# Altium project STEPPER-Board-v1.0.PrjPcb (part 1 of 7)
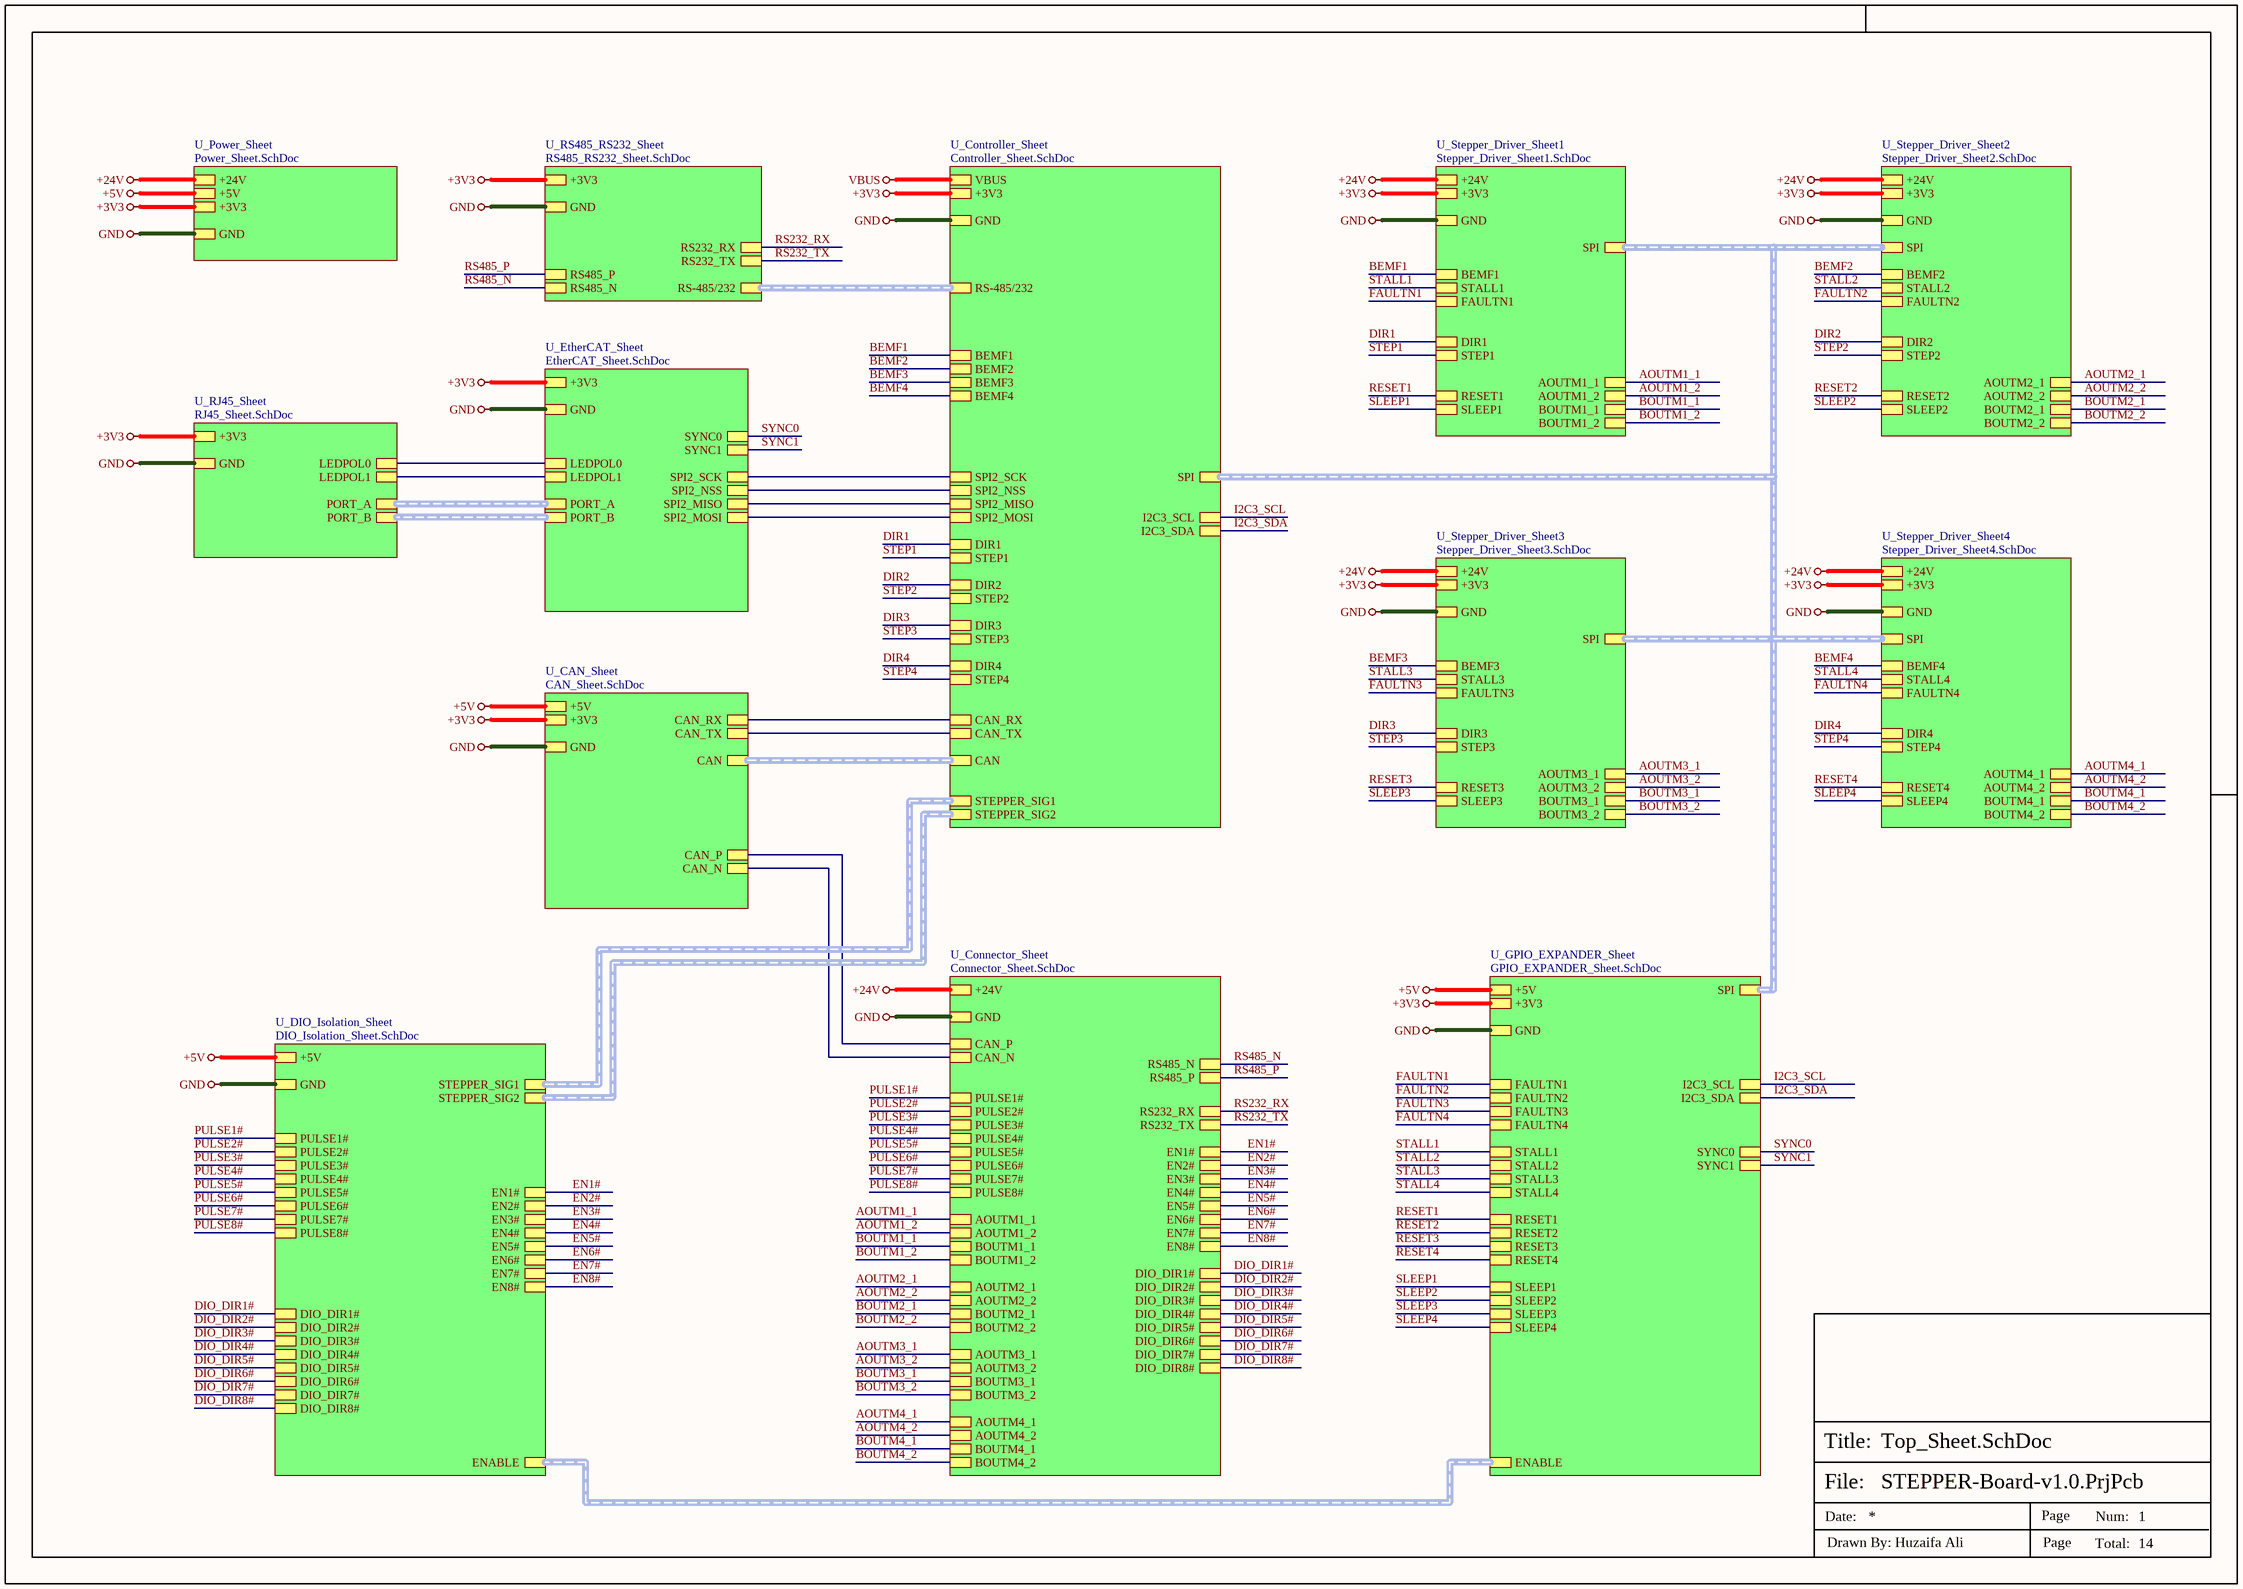
[diagram p0: Top_Sheet.SchDoc]
14 sheets, 379 parts. Net scope: hierarchical (ports join the sheet entries above them; power ports are global).
Sheets:
  Top_Sheet.SchDoc
    U_CAN_Sheet = CAN_Sheet.SchDoc
    U_Connector_Sheet = Connector_Sheet.SchDoc
    U_Controller_Sheet = Controller_Sheet.SchDoc
    U_EtherCAT_Sheet = EtherCAT_Sheet.SchDoc
    U_GPIO_EXPANDER_Sheet = GPIO_EXPANDER_Sheet.SchDoc
    U_Power_Sheet = Power_Sheet.SchDoc
    U_RJ45_Sheet = RJ45_Sheet.SchDoc
    U_RS485_RS232_Sheet = RS485_RS232_Sheet.SchDoc
    U_Stepper_Driver_Sheet1 = Stepper_Driver_Sheet1.SchDoc
    U_Stepper_Driver_Sheet2 = Stepper_Driver_Sheet2.SchDoc
    U_Stepper_Driver_Sheet3 = Stepper_Driver_Sheet3.SchDoc
    U_Stepper_Driver_Sheet4 = Stepper_Driver_Sheet4.SchDoc
    U_DIO_Isolation_Sheet = DIO_Isolation_Sheet.SchDoc

## Sheet Top_Sheet.SchDoc
size 420 x 297 mm; SheetNumber: 1; SheetTotal: 14

### Sub-sheets
U_CAN_Sheet = CAN_Sheet.SchDoc: CAN (harness CAN), CAN_RX, CAN_TX, CAN_P, CAN_N, +5V, +3V3, GND
U_Connector_Sheet = Connector_Sheet.SchDoc: RS485_N, RS485_P, RS232_RX, RS232_TX, CAN_P, CAN_N, AOUTM1_1, AOUTM1_2, BOUTM1_1, BOUTM1_2, AOUTM2_1, AOUTM2_2, BOUTM2_1, BOUTM2_2, AOUTM3_1, AOUTM3_2, BOUTM3_1, BOUTM3_2, AOUTM4_1, AOUTM4_2, BOUTM4_1, BOUTM4_2, +24V, GND, EN1#, EN2#, EN3#, EN4#, EN5#, EN6#, EN7#, EN8#, DIO_DIR1#, DIO_DIR2#, DIO_DIR3#, DIO_DIR4#, DIO_DIR5#, DIO_DIR6#, DIO_DIR7#, DIO_DIR8#, PULSE1#, PULSE2#, PULSE3#, PULSE4#, PULSE5#, PULSE6#, PULSE7#, PULSE8#
U_Controller_Sheet = Controller_Sheet.SchDoc: CAN (harness CAN), CAN_RX, CAN_TX, RS-485/232 (harness RS-485/232), VBUS, +3V3, GND, SPI2_SCK, SPI2_NSS, SPI2_MISO, SPI2_MOSI, STEPPER_SIG1 (harness STEPPER_SIG1), STEPPER_SIG2 (harness STEPPER_SIG2), BEMF1, BEMF2, BEMF3, BEMF4, SPI (harness SPI), DIR1, STEP2, DIR2, STEP3, DIR3, STEP4, DIR4, STEP1, I2C3_SCL, I2C3_SDA
U_DIO_Isolation_Sheet = DIO_Isolation_Sheet.SchDoc: +5V, GND, PULSE1#, PULSE2#, PULSE3#, PULSE4#, PULSE5#, PULSE6#, PULSE7#, PULSE8#, DIO_DIR1#, DIO_DIR2#, DIO_DIR3#, DIO_DIR4#, DIO_DIR5#, DIO_DIR6#, DIO_DIR7#, DIO_DIR8#, EN1#, EN2#, EN3#, EN4#, EN5#, EN6#, EN7#, EN8#, STEPPER_SIG1 (harness STEPPER_SIG1), STEPPER_SIG2 (harness STEPPER_SIG2), ENABLE (harness ENABLE)
U_EtherCAT_Sheet = EtherCAT_Sheet.SchDoc: PORT_A (harness PORT_A), PORT_B (harness PORT_B), LEDPOL0, LEDPOL1, SPI2_SCK, SPI2_NSS, SPI2_MISO, SPI2_MOSI, +3V3, GND, SYNC1, SYNC0
U_GPIO_EXPANDER_Sheet = GPIO_EXPANDER_Sheet.SchDoc: ENABLE (harness ENABLE), SPI (harness SPI), FAULTN1, FAULTN2, FAULTN3, FAULTN4, STALL1, STALL2, STALL3, STALL4, RESET1, RESET2, RESET3, RESET4, I2C3_SCL, I2C3_SDA, SLEEP4, SLEEP3, SLEEP2, SLEEP1, +5V, +3V3, GND, SYNC1, SYNC0
U_Power_Sheet = Power_Sheet.SchDoc: +24V, +5V, +3V3, GND
U_RJ45_Sheet = RJ45_Sheet.SchDoc: PORT_A (harness PORT_A), PORT_B (harness PORT_B), LEDPOL0, LEDPOL1, +3V3, GND
U_RS485_RS232_Sheet = RS485_RS232_Sheet.SchDoc: RS485_N, RS485_P, RS232_RX, RS232_TX, RS-485/232 (harness RS-485/232), +3V3, GND
U_Stepper_Driver_Sheet1 = Stepper_Driver_Sheet1.SchDoc: AOUTM1_1, AOUTM1_2, BOUTM1_1, BOUTM1_2, BEMF1, SPI (harness SPI), STALL1, FAULTN1, DIR1, STEP1, RESET1, SLEEP1, +24V, +3V3, GND
U_Stepper_Driver_Sheet2 = Stepper_Driver_Sheet2.SchDoc: AOUTM2_1, AOUTM2_2, BOUTM2_1, BOUTM2_2, SPI (harness SPI), BEMF2, STALL2, FAULTN2, DIR2, STEP2, RESET2, SLEEP2, +24V, +3V3, GND
U_Stepper_Driver_Sheet3 = Stepper_Driver_Sheet3.SchDoc: AOUTM3_1, AOUTM3_2, BOUTM3_1, BOUTM3_2, SPI (harness SPI), BEMF3, STALL3, FAULTN3, DIR3, STEP3, RESET3, SLEEP3, +24V, +3V3, GND
U_Stepper_Driver_Sheet4 = Stepper_Driver_Sheet4.SchDoc: AOUTM4_1, AOUTM4_2, BOUTM4_1, BOUTM4_2, SPI (harness SPI), BEMF4, STALL4, FAULTN4, DIR4, STEP4, RESET4, SLEEP4, +24V, +3V3, GND

### Nets
+3V3: sheet U_CAN_Sheet/+3V3, sheet U_Controller_Sheet/+3V3, sheet U_EtherCAT_Sheet/+3V3, sheet U_GPIO_EXPANDER_Sheet/+3V3, sheet U_Power_Sheet/+3V3, sheet U_RJ45_Sheet/+3V3, sheet U_RS485_RS232_Sheet/+3V3, sheet U_Stepper_Driver_Sheet1/+3V3, sheet U_Stepper_Driver_Sheet2/+3V3, sheet U_Stepper_Driver_Sheet3/+3V3, sheet U_Stepper_Driver_Sheet4/+3V3
+5V: sheet U_CAN_Sheet/+5V, sheet U_GPIO_EXPANDER_Sheet/+5V, sheet U_Power_Sheet/+5V, sheet U_DIO_Isolation_Sheet/+5V
+24V: sheet U_Connector_Sheet/+24V, sheet U_Power_Sheet/+24V, sheet U_Stepper_Driver_Sheet1/+24V, sheet U_Stepper_Driver_Sheet2/+24V, sheet U_Stepper_Driver_Sheet3/+24V, sheet U_Stepper_Driver_Sheet4/+24V
GND: sheet U_CAN_Sheet/GND, sheet U_Connector_Sheet/GND, sheet U_Controller_Sheet/GND, sheet U_EtherCAT_Sheet/GND, sheet U_GPIO_EXPANDER_Sheet/GND, sheet U_Power_Sheet/GND, sheet U_RJ45_Sheet/GND, sheet U_RS485_RS232_Sheet/GND, sheet U_Stepper_Driver_Sheet1/GND, sheet U_Stepper_Driver_Sheet2/GND, sheet U_Stepper_Driver_Sheet3/GND, sheet U_Stepper_Driver_Sheet4/GND, sheet U_DIO_Isolation_Sheet/GND
RS232_RX: sheet U_Connector_Sheet/RS232_RX, sheet U_RS485_RS232_Sheet/RS232_RX
RS232_TX: sheet U_Connector_Sheet/RS232_TX, sheet U_RS485_RS232_Sheet/RS232_TX
VBUS: sheet U_Controller_Sheet/VBUS
AOUTM1_1: sheet U_Connector_Sheet/AOUTM1_1, sheet U_Stepper_Driver_Sheet1/AOUTM1_1
AOUTM1_2: sheet U_Connector_Sheet/AOUTM1_2, sheet U_Stepper_Driver_Sheet1/AOUTM1_2
AOUTM2_1: sheet U_Connector_Sheet/AOUTM2_1, sheet U_Stepper_Driver_Sheet2/AOUTM2_1
AOUTM2_2: sheet U_Connector_Sheet/AOUTM2_2, sheet U_Stepper_Driver_Sheet2/AOUTM2_2
AOUTM3_1: sheet U_Connector_Sheet/AOUTM3_1, sheet U_Stepper_Driver_Sheet3/AOUTM3_1
AOUTM3_2: sheet U_Connector_Sheet/AOUTM3_2, sheet U_Stepper_Driver_Sheet3/AOUTM3_2
AOUTM4_1: sheet U_Connector_Sheet/AOUTM4_1, sheet U_Stepper_Driver_Sheet4/AOUTM4_1
AOUTM4_2: sheet U_Connector_Sheet/AOUTM4_2, sheet U_Stepper_Driver_Sheet4/AOUTM4_2
BEMF1: sheet U_Controller_Sheet/BEMF1, sheet U_Stepper_Driver_Sheet1/BEMF1
BEMF2: sheet U_Controller_Sheet/BEMF2, sheet U_Stepper_Driver_Sheet2/BEMF2
BEMF3: sheet U_Controller_Sheet/BEMF3, sheet U_Stepper_Driver_Sheet3/BEMF3
BEMF4: sheet U_Controller_Sheet/BEMF4, sheet U_Stepper_Driver_Sheet4/BEMF4
BOUTM1_1: sheet U_Connector_Sheet/BOUTM1_1, sheet U_Stepper_Driver_Sheet1/BOUTM1_1
BOUTM1_2: sheet U_Connector_Sheet/BOUTM1_2, sheet U_Stepper_Driver_Sheet1/BOUTM1_2
BOUTM2_1: sheet U_Connector_Sheet/BOUTM2_1, sheet U_Stepper_Driver_Sheet2/BOUTM2_1
BOUTM2_2: sheet U_Connector_Sheet/BOUTM2_2, sheet U_Stepper_Driver_Sheet2/BOUTM2_2
BOUTM3_1: sheet U_Connector_Sheet/BOUTM3_1, sheet U_Stepper_Driver_Sheet3/BOUTM3_1
BOUTM3_2: sheet U_Connector_Sheet/BOUTM3_2, sheet U_Stepper_Driver_Sheet3/BOUTM3_2
BOUTM4_1: sheet U_Connector_Sheet/BOUTM4_1, sheet U_Stepper_Driver_Sheet4/BOUTM4_1
BOUTM4_2: sheet U_Connector_Sheet/BOUTM4_2, sheet U_Stepper_Driver_Sheet4/BOUTM4_2
CAN_N: sheet U_CAN_Sheet/CAN_N, sheet U_Connector_Sheet/CAN_N
CAN_P: sheet U_CAN_Sheet/CAN_P, sheet U_Connector_Sheet/CAN_P
CAN_RX: sheet U_CAN_Sheet/CAN_RX, sheet U_Controller_Sheet/CAN_RX
CAN_TX: sheet U_CAN_Sheet/CAN_TX, sheet U_Controller_Sheet/CAN_TX
DIO_DIR1#: sheet U_Connector_Sheet/DIO_DIR1#, sheet U_DIO_Isolation_Sheet/DIO_DIR1#
DIO_DIR2#: sheet U_Connector_Sheet/DIO_DIR2#, sheet U_DIO_Isolation_Sheet/DIO_DIR2#
DIO_DIR3#: sheet U_Connector_Sheet/DIO_DIR3#, sheet U_DIO_Isolation_Sheet/DIO_DIR3#
DIO_DIR4#: sheet U_Connector_Sheet/DIO_DIR4#, sheet U_DIO_Isolation_Sheet/DIO_DIR4#
DIO_DIR5#: sheet U_Connector_Sheet/DIO_DIR5#, sheet U_DIO_Isolation_Sheet/DIO_DIR5#
DIO_DIR6#: sheet U_Connector_Sheet/DIO_DIR6#, sheet U_DIO_Isolation_Sheet/DIO_DIR6#
DIO_DIR7#: sheet U_Connector_Sheet/DIO_DIR7#, sheet U_DIO_Isolation_Sheet/DIO_DIR7#
DIO_DIR8#: sheet U_Connector_Sheet/DIO_DIR8#, sheet U_DIO_Isolation_Sheet/DIO_DIR8#
DIR1: sheet U_Controller_Sheet/DIR1, sheet U_Stepper_Driver_Sheet1/DIR1
DIR2: sheet U_Controller_Sheet/DIR2, sheet U_Stepper_Driver_Sheet2/DIR2
DIR3: sheet U_Controller_Sheet/DIR3, sheet U_Stepper_Driver_Sheet3/DIR3
DIR4: sheet U_Controller_Sheet/DIR4, sheet U_Stepper_Driver_Sheet4/DIR4
EN1#: sheet U_Connector_Sheet/EN1#, sheet U_DIO_Isolation_Sheet/EN1#
EN2#: sheet U_Connector_Sheet/EN2#, sheet U_DIO_Isolation_Sheet/EN2#
EN3#: sheet U_Connector_Sheet/EN3#, sheet U_DIO_Isolation_Sheet/EN3#
EN4#: sheet U_Connector_Sheet/EN4#, sheet U_DIO_Isolation_Sheet/EN4#
EN5#: sheet U_Connector_Sheet/EN5#, sheet U_DIO_Isolation_Sheet/EN5#
EN6#: sheet U_Connector_Sheet/EN6#, sheet U_DIO_Isolation_Sheet/EN6#
EN7#: sheet U_Connector_Sheet/EN7#, sheet U_DIO_Isolation_Sheet/EN7#
EN8#: sheet U_Connector_Sheet/EN8#, sheet U_DIO_Isolation_Sheet/EN8#
FAULTN1: sheet U_GPIO_EXPANDER_Sheet/FAULTN1, sheet U_Stepper_Driver_Sheet1/FAULTN1
FAULTN2: sheet U_GPIO_EXPANDER_Sheet/FAULTN2, sheet U_Stepper_Driver_Sheet2/FAULTN2
FAULTN3: sheet U_GPIO_EXPANDER_Sheet/FAULTN3, sheet U_Stepper_Driver_Sheet3/FAULTN3
FAULTN4: sheet U_GPIO_EXPANDER_Sheet/FAULTN4, sheet U_Stepper_Driver_Sheet4/FAULTN4
I2C3_SCL: sheet U_Controller_Sheet/I2C3_SCL, sheet U_GPIO_EXPANDER_Sheet/I2C3_SCL
I2C3_SDA: sheet U_Controller_Sheet/I2C3_SDA, sheet U_GPIO_EXPANDER_Sheet/I2C3_SDA
LEDPOL0: sheet U_EtherCAT_Sheet/LEDPOL0, sheet U_RJ45_Sheet/LEDPOL0
LEDPOL1: sheet U_EtherCAT_Sheet/LEDPOL1, sheet U_RJ45_Sheet/LEDPOL1
PULSE1#: sheet U_Connector_Sheet/PULSE1#, sheet U_DIO_Isolation_Sheet/PULSE1#
PULSE2#: sheet U_Connector_Sheet/PULSE2#, sheet U_DIO_Isolation_Sheet/PULSE2#
PULSE3#: sheet U_Connector_Sheet/PULSE3#, sheet U_DIO_Isolation_Sheet/PULSE3#
PULSE4#: sheet U_Connector_Sheet/PULSE4#, sheet U_DIO_Isolation_Sheet/PULSE4#
PULSE5#: sheet U_Connector_Sheet/PULSE5#, sheet U_DIO_Isolation_Sheet/PULSE5#
PULSE6#: sheet U_Connector_Sheet/PULSE6#, sheet U_DIO_Isolation_Sheet/PULSE6#
PULSE7#: sheet U_Connector_Sheet/PULSE7#, sheet U_DIO_Isolation_Sheet/PULSE7#
PULSE8#: sheet U_Connector_Sheet/PULSE8#, sheet U_DIO_Isolation_Sheet/PULSE8#
RESET1: sheet U_GPIO_EXPANDER_Sheet/RESET1, sheet U_Stepper_Driver_Sheet1/RESET1
RESET2: sheet U_GPIO_EXPANDER_Sheet/RESET2, sheet U_Stepper_Driver_Sheet2/RESET2
RESET3: sheet U_GPIO_EXPANDER_Sheet/RESET3, sheet U_Stepper_Driver_Sheet3/RESET3
RESET4: sheet U_GPIO_EXPANDER_Sheet/RESET4, sheet U_Stepper_Driver_Sheet4/RESET4
RS485_N: sheet U_Connector_Sheet/RS485_N, sheet U_RS485_RS232_Sheet/RS485_N
RS485_P: sheet U_Connector_Sheet/RS485_P, sheet U_RS485_RS232_Sheet/RS485_P
SLEEP1: sheet U_GPIO_EXPANDER_Sheet/SLEEP1, sheet U_Stepper_Driver_Sheet1/SLEEP1
SLEEP2: sheet U_GPIO_EXPANDER_Sheet/SLEEP2, sheet U_Stepper_Driver_Sheet2/SLEEP2
SLEEP3: sheet U_GPIO_EXPANDER_Sheet/SLEEP3, sheet U_Stepper_Driver_Sheet3/SLEEP3
SLEEP4: sheet U_GPIO_EXPANDER_Sheet/SLEEP4, sheet U_Stepper_Driver_Sheet4/SLEEP4
SPI2_MISO: sheet U_Controller_Sheet/SPI2_MISO, sheet U_EtherCAT_Sheet/SPI2_MISO
SPI2_MOSI: sheet U_Controller_Sheet/SPI2_MOSI, sheet U_EtherCAT_Sheet/SPI2_MOSI
SPI2_NSS: sheet U_Controller_Sheet/SPI2_NSS, sheet U_EtherCAT_Sheet/SPI2_NSS
SPI2_SCK: sheet U_Controller_Sheet/SPI2_SCK, sheet U_EtherCAT_Sheet/SPI2_SCK
STALL1: sheet U_GPIO_EXPANDER_Sheet/STALL1, sheet U_Stepper_Driver_Sheet1/STALL1
STALL2: sheet U_GPIO_EXPANDER_Sheet/STALL2, sheet U_Stepper_Driver_Sheet2/STALL2
STALL3: sheet U_GPIO_EXPANDER_Sheet/STALL3, sheet U_Stepper_Driver_Sheet3/STALL3
STALL4: sheet U_GPIO_EXPANDER_Sheet/STALL4, sheet U_Stepper_Driver_Sheet4/STALL4
STEP1: sheet U_Controller_Sheet/STEP1, sheet U_Stepper_Driver_Sheet1/STEP1
STEP2: sheet U_Controller_Sheet/STEP2, sheet U_Stepper_Driver_Sheet2/STEP2
STEP3: sheet U_Controller_Sheet/STEP3, sheet U_Stepper_Driver_Sheet3/STEP3
STEP4: sheet U_Controller_Sheet/STEP4, sheet U_Stepper_Driver_Sheet4/STEP4
SYNC0: sheet U_EtherCAT_Sheet/SYNC0, sheet U_GPIO_EXPANDER_Sheet/SYNC0
SYNC1: sheet U_EtherCAT_Sheet/SYNC1, sheet U_GPIO_EXPANDER_Sheet/SYNC1

### Buses and harness runs
harness sheet U_CAN_Sheet/CAN = sheet U_Controller_Sheet/CAN
harness sheet U_Controller_Sheet/RS-485/232 = sheet U_RS485_RS232_Sheet/RS-485/232
harness sheet U_Controller_Sheet/SPI = sheet U_GPIO_EXPANDER_Sheet/SPI = sheet U_Stepper_Driver_Sheet1/SPI = sheet U_Stepper_Driver_Sheet2/SPI = sheet U_Stepper_Driver_Sheet3/SPI = sheet U_Stepper_Driver_Sheet4/SPI
harness sheet U_Controller_Sheet/STEPPER_SIG1 = sheet U_DIO_Isolation_Sheet/STEPPER_SIG1
harness sheet U_Controller_Sheet/STEPPER_SIG2 = sheet U_DIO_Isolation_Sheet/STEPPER_SIG2
harness sheet U_DIO_Isolation_Sheet/ENABLE = sheet U_GPIO_EXPANDER_Sheet/ENABLE
harness sheet U_EtherCAT_Sheet/PORT_A = sheet U_RJ45_Sheet/PORT_A
harness sheet U_EtherCAT_Sheet/PORT_B = sheet U_RJ45_Sheet/PORT_B

### Notes on the sheet
- File:
- Title:
- Date:
- Page
- Num:
- Total:
- Drawn By: Huzaifa Ali

## Sheet CAN_Sheet.SchDoc
size 420 x 297 mm; SheetNumber: 4; SheetTotal: 14
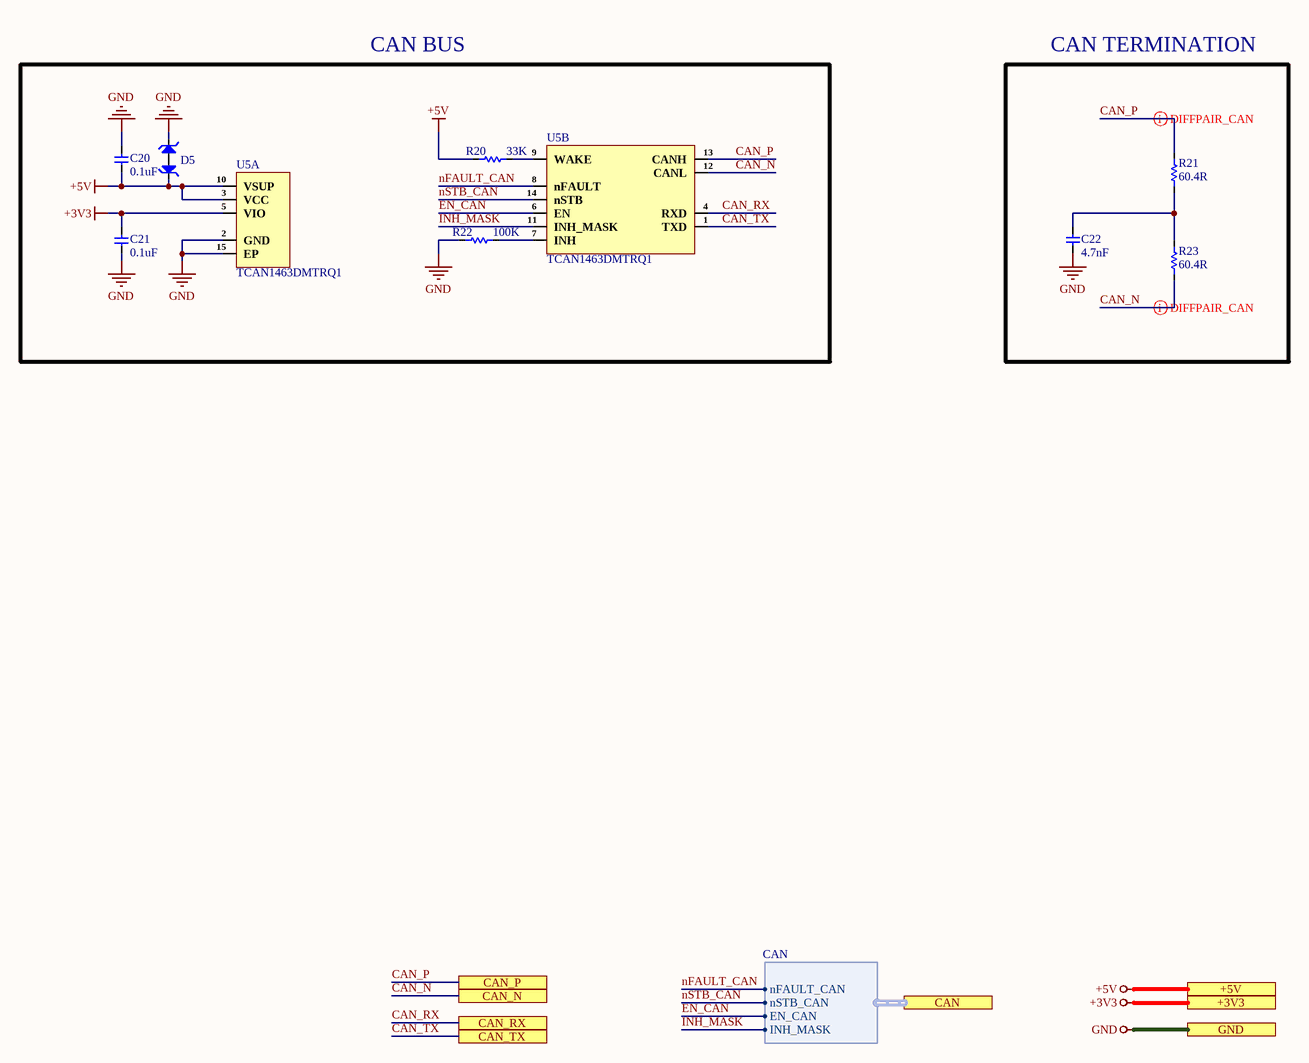
[diagram p1: CAN_Sheet.SchDoc]

### Parts
C20  0.1uF  [Cap-0402]
C21  0.1uF  [Cap-0402]
C22  4.7nF  [Cap-0402]
D5  PESD5V0H1BSFYL  [DSN0603-2]  (value not drawn)
R20  33K  [Res-0402]
R21  60.4R  [Res-0603]
R22  100K  [Res-0402]
R23  60.4R  [Res-0603]
U5  TCAN1463DMTRQ1  [VSON-14(3x4.5)]  (parts A,B of 2)

### Ports
+3V3 (see Top_Sheet[2B], Controller_Sheet[5D], EtherCAT_Sheet[5D], GPIO_EXPANDER_Sheet[5D], Power_Sheet[5D], RJ45_Sheet[5D], RS485_RS232_Sheet[2D], Stepper_Driver_Sheet1[5D], Stepper_Driver_Sheet2[5D], Stepper_Driver_Sheet3[5D], Stepper_Driver_Sheet4[5D]), +5V (see Top_Sheet[2B], DIO_Isolation_Sheet[5D], GPIO_EXPANDER_Sheet[5D], Power_Sheet[5D]), CAN (harness CAN, see Top_Sheet[2B], Controller_Sheet[4D]), CAN_N, CAN_P, CAN_RX (see Top_Sheet[2B], Controller_Sheet[5D]), CAN_TX (see Top_Sheet[2B], Controller_Sheet[5D]), GND (see Top_Sheet[2B], Connector_Sheet[5D], Controller_Sheet[5D], DIO_Isolation_Sheet[5D], EtherCAT_Sheet[5D], GPIO_EXPANDER_Sheet[5D], Power_Sheet[5D], RJ45_Sheet[5D], RS485_RS232_Sheet[2D], Stepper_Driver_Sheet1[5D], Stepper_Driver_Sheet2[5D], Stepper_Driver_Sheet3[5D], Stepper_Driver_Sheet4[5D])

### Harnesses
CAN: nFAULT_CAN, nSTB_CAN, EN_CAN, INH_MASK

### Nets
+3V3: C21.2 U5.5(VIO) ; port +3V3
+5V: C20.1 D5.1 R20.1 U5.3(VCC) U5.10(VSUP) ; port +5V
GND: C20.2 C21.1 C22.2 D5.2 R22.1 U5.2(GND) U5.15(EP) ; port GND
CAN_N: R23.2 U5.12(CANL) ; port CAN_N
CAN_P: R21.1 U5.13(CANH) ; port CAN_P
CAN_RX: U5.4(RXD) ; port CAN_RX
CAN_TX: U5.1(TXD) ; port CAN_TX
EN_CAN: U5.6(EN) ; port CAN.EN_CAN
INH_MASK: U5.11(INH_MASK) ; port CAN.INH_MASK
nFAULT_CAN: U5.8(nFAULT) ; port CAN.nFAULT_CAN
nSTB_CAN: U5.14(nSTB) ; port CAN.nSTB_CAN
NetC22_1: C22.1 R21.2 R23.1
NetR20_2: R20.2 U5.9(WAKE)
NetR22_2: R22.2 U5.7(INH)

### Layout directives
differential pair; net class CAN; differential pair class CAN_Lines: CAN_N, CAN_P

### Notes on the sheet
- CAN BUS
- CAN TERMINATION
- File:
- Title:
- Date:
- Page
- Num:
- Total:
- Drawn By: Huzaifa Ali

### Library data of the parts
C20 C21 = CC0402JRX7R7BB104: CAP CER 0.1UF 16V X7R 0402; Manufacturer: Yageo; Material: 4241ConductorMaterial; Value: 100nF; Tolerance: 5%; Item Type: Capacitor; Supplier: Digikey; Supplier Part Number: 311-1676-1-ND; Manufacturer Part Number: CC0402JRX7R7BB104; RoHS: Yes; Category: Ceramic Capacitors; Stock: 1659111; Pricing: 1=0.1, 10=0.046, 50=0.0262, 100=0.0203, 500=0.01528, 1000=0.012, 2500=0.01091, 5000=0.01004 (USD); Mounting Technology: Surface Mount; Case/Package: 0402; Case Code (Metric): 1005; Case Code (Imperial): 0402; Min Operating Temperature: -55°C; Max Operating Temperature: 125°C; Dielectric: X7R; Packaging: Tape and Reel; Package Quantity: 10000; Voltage Rating (DC): 16V; Voltage Rating: 16V; Series: CC; Construction: Flat; Length: 0.039inch; Width: 0.02inch; Height: 0.5mm; Thickness: 0.022inch; Lead Free: Lead Free; Halogen Free: Halogen Free; RoHS Compliant: Yes; ComponentLink1URL: https://datasheet.ciiva.com/13210/upy-gphc-x7r-6-3v-to-50v-8-12304-13210152.pdf?src-supplier=Mouser; ComponentLink1Description: https://datasheet.ciiva.com/13210/upy-gphc-x7r-6-3v-to-50v-8-12304-13210152.pdf?src-supplier=Mouser; LCSC Part Number: C541464
C22 = CC0402KRX7R9BB472: CAP CER 4700PF 50V X7R 0402; Manufacturer: Yageo; Material: 4241ConductorMaterial; Tolerance: 10%; Temperature Coefficient: 30ppm/°C; Item Type: Capacitor; Supplier 1: Future Electronics; Manufacturer Part Number: CC0402KRX7R9BB472; RoHS: Yes; Category: Ceramic Capacitors; Stock 1: 1780000; Pricing 1: 10000=0.0021, 40000=0.002, 150000=0.0019, 400000=0.0018, 1000000=0.0017 (USD); Mount: Surface Mount; Case/Package: 0402; Number of Pins: 2NUMBER; Case Code (Imperial): 0402; Case Code (Metric): 1005; Min Operating Temperature: -55°C; Max Operating Temperature: 125°C; Capacitance: 4.7nF; Dielectric: X7R; Voltage Rating: 50V; Voltage Rating (DC): 50V; Packaging: Tape and Reel; Package Quantity: 1; Termination: SMD/SMT; Series: CC; Construction: Flat; Length: 1mm; Width: 0.02inch; Height: 0.5mm; Thickness: 0.022inch; Depth: 0.5mm; Radiation Hardening: No; Reach SVHC Compliant: No; RoHS Compliant: Yes; Halogen Free: 5694HalogenFree; Lead Free: 5697LeadFree; ComponentLink1URL: https://datasheet.ciiva.com/7978/1489800-7978108.pdf?src-supplier=Element14; ComponentLink1Description: https://datasheet.ciiva.com/7978/1489800-7978108.pdf?src-supplier=Element14; ComponentLink2URL: https://datasheet.ciiva.com/176/mlccorderingcode-176364.pdf?src-supplier=Digikey; ComponentLink2Description: https://datasheet.ciiva.com/176/mlccorderingcode-176364.pdf?src-supplier=Digikey; ComponentLink3URL: https://datasheet.ciiva.com/176/mlccorderingcode-176363.pdf?src-supplier=Digikey; ComponentLink3Description: https://datasheet.ciiva.com/176/mlccorderingcode-176363.pdf?src-supplier=Digikey; ComponentLink4URL: https://datasheet.ciiva.com/176/mlccorderingcode-176365.pdf?src-supplier=Digikey; ComponentLink4Description: https://datasheet.ciiva.com/176/mlccorderingcode-176365.pdf?src-supplier=Digikey; ComponentLink5URL: https://datasheet.ciiva.com/11586/upy-gphc-x7r-6-3v-to-50v-8-11586491.pdf?src-supplier=Avnet; ComponentLink5Description: https://datasheet.ciiva.com/11586/upy-gphc-x7r-6-3v-to-50v-8-11586491.pdf?src-supplier=Avnet; Supplier Part Number 1: 1989300
D5 = PESD5V0H1BSFYL: TVS DIODE 5VWM 6.3VC DSN0603-2; Manufacturer: Nexperia; Supplier 1: Avnet; Manufacturer Part Number: PESD5V0H1BSFYL; RoHS: Yes; Category: ESD and Circuit Protection ICs; Stock 1: 9000; Pricing 1: 18000=0.06453, 36000=0.06278, 54000=0.06104, 90000=0.05930, 180000=0.05755, 900000=0.05581, 1800000=0.05406 (USD); RoHS Compliant: Yes; ComponentLink1URL: http://www.farnell.com/datasheets/1961312.pdf?src-supplier=Farnell; ComponentLink1Description: http://www.farnell.com/datasheets/1961312.pdf?src-supplier=Farnell; ComponentLink2URL: https://assets.nexperia.com/documents/data-sheet/PESD5V0H1BSF.pdf?src-supplier=Digi-Key; ComponentLink2Description: https://assets.nexperia.com/documents/data-sheet/PESD5V0H1BSF.pdf?src-supplier=Digi-Key; ComponentLink3URL: http://www.farnell.com/datasheets/1961312.pdf?src-supplier=Newark; ComponentLink3Description: http://www.farnell.com/datasheets/1961312.pdf?src-supplier=Newark; Supplier Part Number 1: PESD5V0H1BSFYL; LCSC Part Number: C477989; Item Type: Diode
R20 = RC0402FR-0733KL: RES 33K OHM 1% 1/16W 0402; Manufacturer: YAGEO; Item Type: Resistor; Manufacturer Part Number: RC0402FR-0733KL; Package: 0402; LCSC Part Number: C138003; ComponentLink1Description: LCSC; ComponentLink1URL: https://www.lcsc.com/product-detail/Chip-Resistor-Surface-Mount_YAGEO-RC0402FR-0733KL_C138003.html
R21 R23 = RTT0360R4FTP: 100mW Thick Film Resistors ±100ppm/℃ ±1% 60.4Ω 0603 Chip Resistor - Surface Mount ROHS; Manuacturer: RALEC; Manufacturer Part Number: RTT0360R4FTP; Package: 0603; Value: 60.4R; LCSC Part Number: C103744; ComponentLink1Description: LCSC; ComponentLink1URL: https://www.lcsc.com/product-detail/Chip-Resistor-Surface-Mount_RALEC-RTT0360R4FTP_C103744.html
R22 = RC0402FR-07100KL: RES 100K OHM 1% 1/16W 0402; Manufacturer: Yageo; Resistance: 100kR; Temperature Coefficient: 100ppm/°C; Power Rating: 63mW; Voltage Rating: 50V; Item Type: Resistor; Supplier 1: Mouser; Manufacturer Part Number: RC0402FR-07100KL; RoHS: Yes; Category: Chip SMD Resistors; Stock 1: 7759549; Pricing 1: 1=0.10000, 10=0.01200, 50=0.01200, 100=0.00500, 1000=0.00300, 2500=0.00200, 10000=0.00100 (USD); Case/Package: 0402; Case Code (Metric): 1005; Case Code (Imperial): 0402; Min Operating Temperature: -55°C; Max Operating Temperature: 155°C; Resistor Type: Thick Film; Tolerance: 1%; Packaging: Tape and Reel; Package Quantity: 1; Number of Terminations: 2; Termination: SMD/SMT; Max Power Dissipation: 63mW; Working Voltage: 50V; Features: Moisture Resistant; Series: RC; Resistance Tolerance: 1%; Construction: Rectangular; Technology: THICK FILM; Length: 0.039inch; Width: 0.02inch; Height: 0.016inch; Depth: 0.5mm; REACH SVHC: No SVHC; Lead Free: Lead Free; RoHS Compliant: Yes; Military Standard: Not; ComponentLink1URL: https://datasheet.ciiva.com/11819/0900766b80c66297-11819452.pdf?src-supplier=RSComponents; ComponentLink1Description: https://datasheet.ciiva.com/11819/0900766b80c66297-11819452.pdf?src-supplier=RSComponents; ComponentLink2URL: https://datasheet.ciiva.com/22747/1018594-22747509.pdf?src-supplier=Element14; ComponentLink2Description: https://datasheet.ciiva.com/22747/1018594-22747509.pdf?src-supplier=Element14; ComponentLink3URL: https://datasheet.ciiva.com/2453/pyu-r-int-thick-7-2453362.pdf?src-supplier=Digi-Key; ComponentLink3Description: https://datasheet.ciiva.com/2453/pyu-r-int-thick-7-2453362.pdf?src-supplier=Digi-Key; ComponentLink4URL: https://datasheet.ciiva.com/2453/pyu-r-int-thick-7-2453363.pdf?src-supplier=Digi-Key; ComponentLink4Description: https://datasheet.ciiva.com/2453/pyu-r-int-thick-7-2453363.pdf?src-supplier=Digi-Key; ComponentLink5URL: https://datasheet.ciiva.com/2453/pyu-r-int-thick-7-2453361.pdf?src-supplier=Digi-Key; ComponentLink5Description: https://datasheet.ciiva.com/2453/pyu-r-int-thick-7-2453361.pdf?src-supplier=Digi-Key; ComponentLink6URL: https://datasheet.ciiva.com/12667/pyu-rc0402-51-rohs-l-6-r-12667930.pdf?src-supplier=Mouser; ComponentLink6Description: https://datasheet.ciiva.com/12667/pyu-rc0402-51-rohs-l-6-r-12667930.pdf?src-supplier=Mouser; ComponentLink7URL: https://datasheet.ciiva.com/15189/getdatasheetpartid-323696-15189334.pdf?src-supplier=Verical; ComponentLink7Description: https://datasheet.ciiva.com/15189/getdatasheetpartid-323696-15189334.pdf?src-supplier=Verical; Supplier Part Number 1: 603-RC0402FR-07100KL; LCSC Part Number: C60491
U5 = TCAN1463DMTRQ1: IC TRANSCEIVER HALF 1/1 14VSON; Manufacturer: Texas Instruments; Supplier: Mouser; Supplier Part Number: 595-TCAN1463DMTRQ1; Manufacturer Part Number: TCAN1463DMTRQ1; RoHS: Yes; Item Type: IC; Stock: 20610; Pricing: 1=2.47, 10=2.22, 50=2.22, 100=1.78, 1000=1.21, 10000=1.09 (USD); LCSC Part Number: C5215823

## Sheet Connector_Sheet.SchDoc
size 420 x 297 mm; SheetNumber: 13; SheetTotal: 14
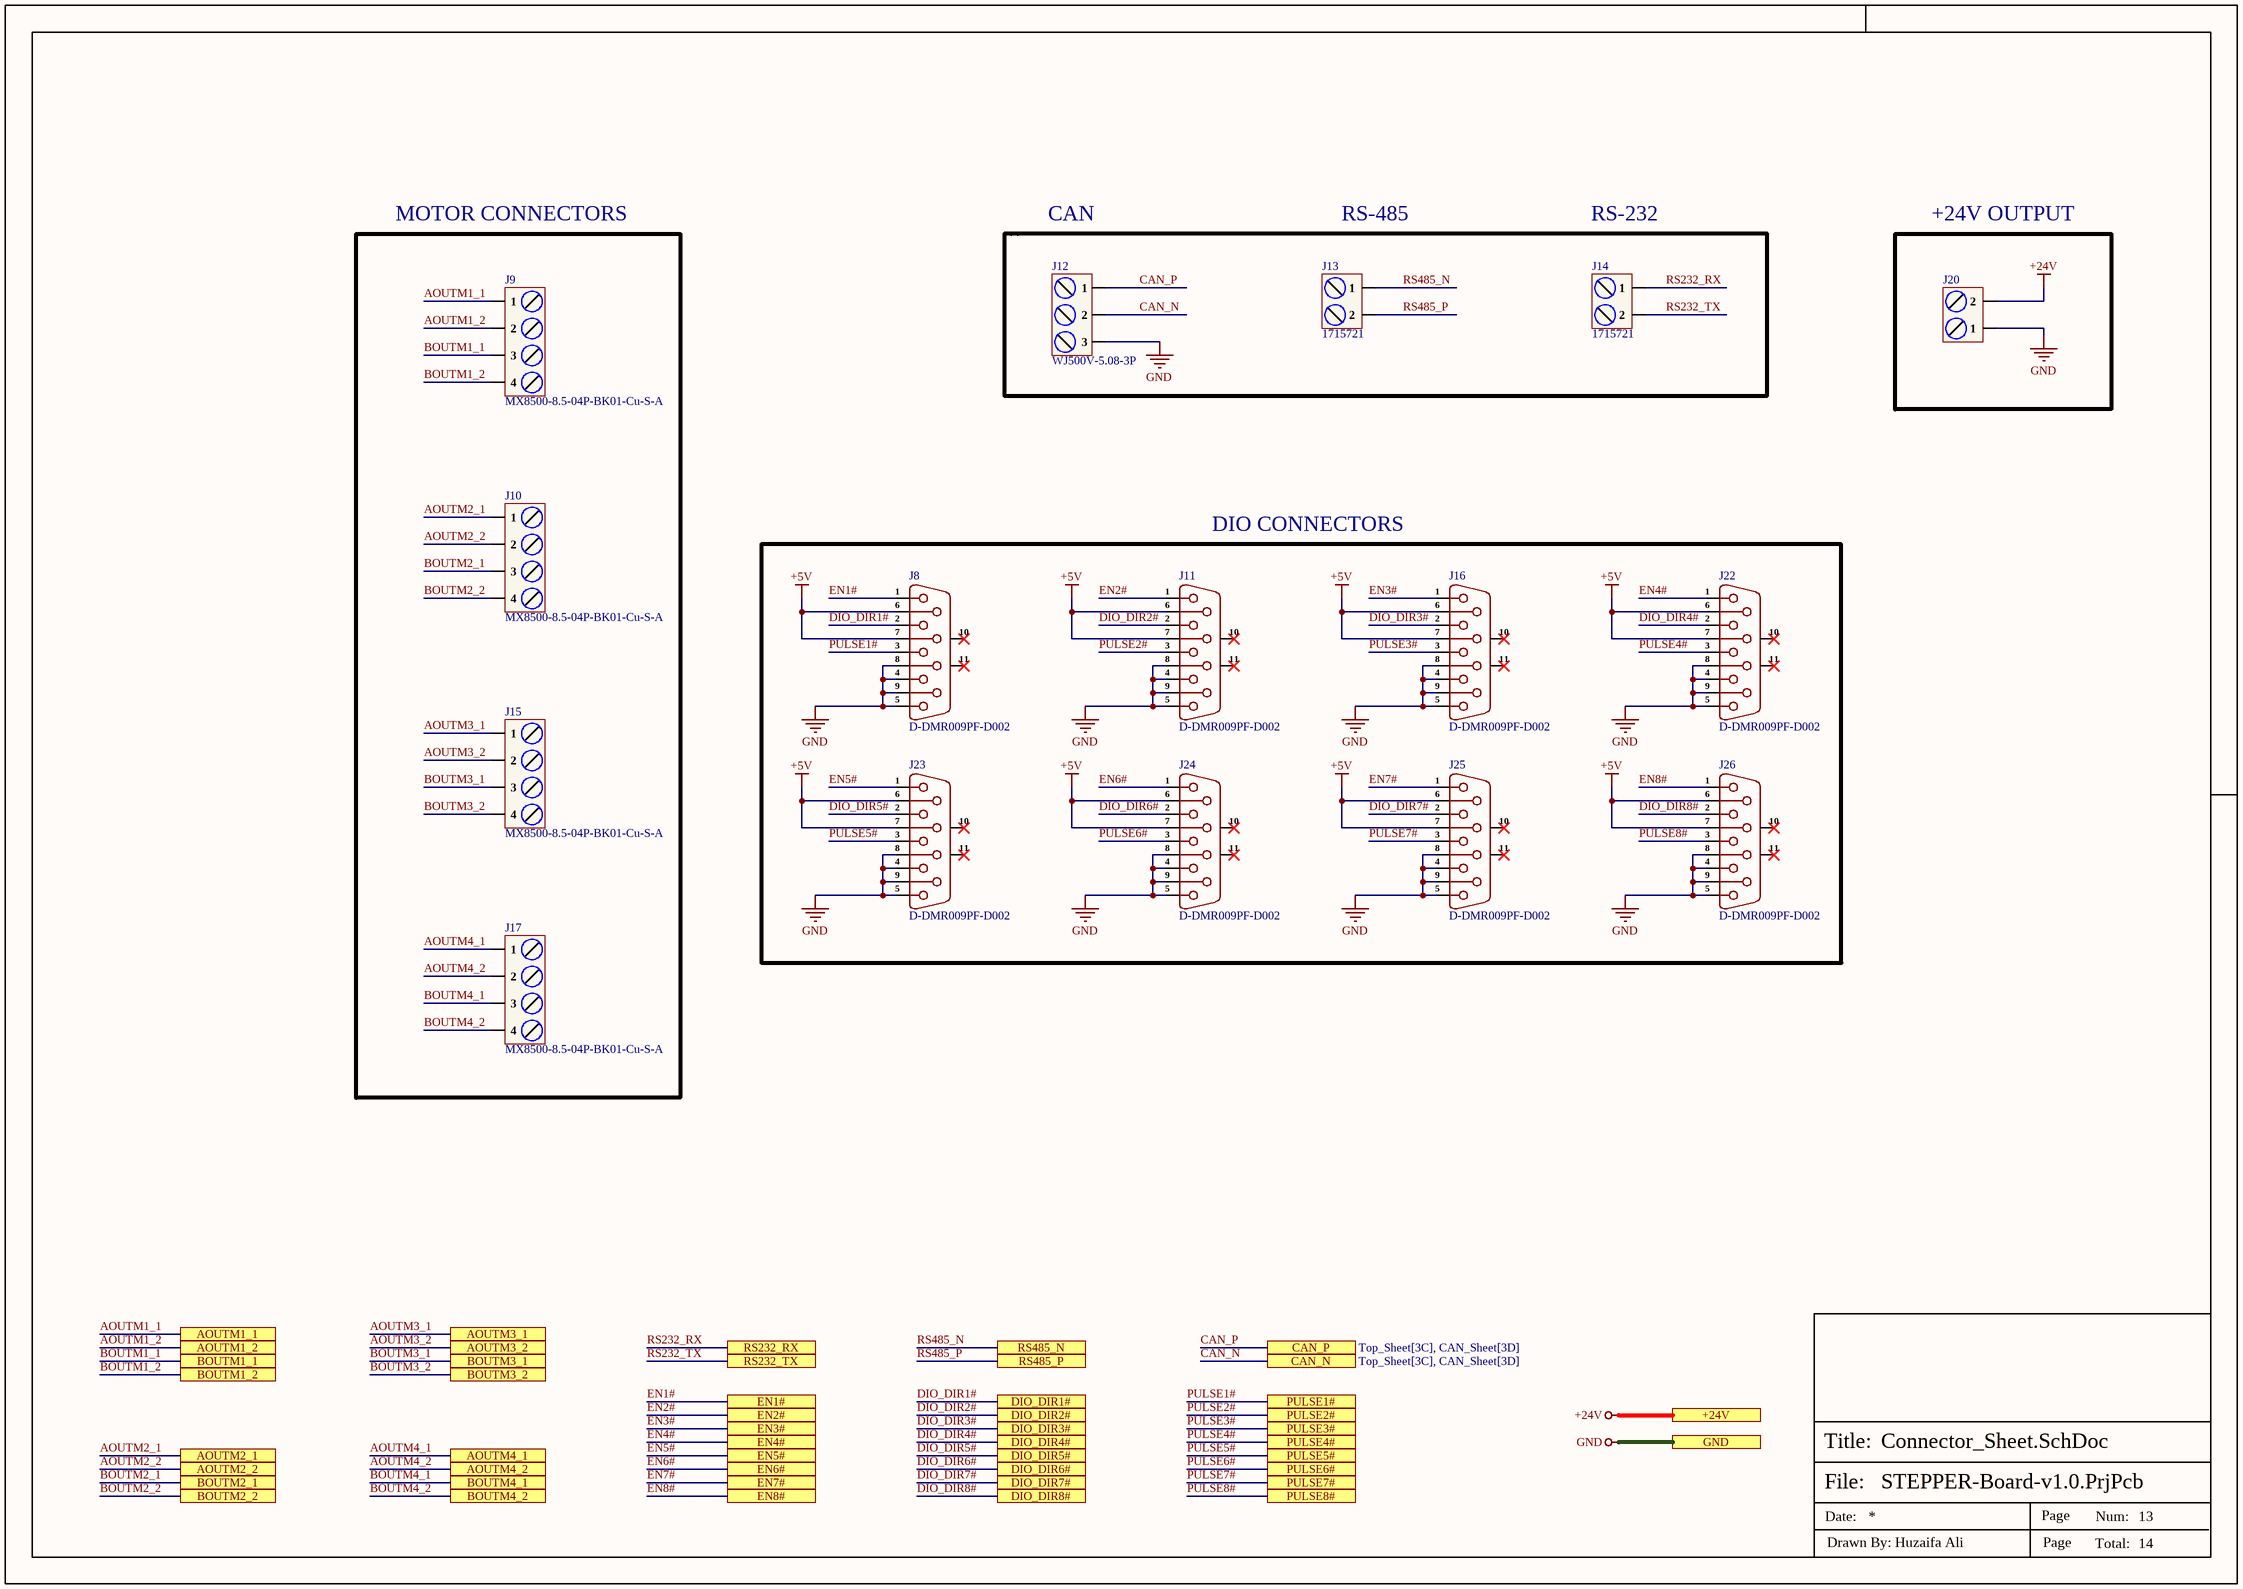
[diagram p2: Connector_Sheet.SchDoc]

### Parts
J8  D-DMR009PF-D002  [D-DMR009PF-D002]
J9  MX8500-8.5-04P-BK01-Cu-S-A  [MX8500-8.5-04P-BK01-Cu-S-A]
J10  MX8500-8.5-04P-BK01-Cu-S-A  [MX8500-8.5-04P-BK01-Cu-S-A]
J11  D-DMR009PF-D002  [D-DMR009PF-D002]
J12  WJ500V-5.08-3P  [WJ500V-5.08-3P]
J13  1715721  [1715721]
J14  1715721  [1715721]
J15  MX8500-8.5-04P-BK01-Cu-S-A  [MX8500-8.5-04P-BK01-Cu-S-A]
J16  D-DMR009PF-D002  [D-DMR009PF-D002]
J17  MX8500-8.5-04P-BK01-Cu-S-A  [MX8500-8.5-04P-BK01-Cu-S-A]
J20  MXHB9500-9.5-02P-BK01-Cu-S-A  [MXHB9500-9.5-02P-BK01-Cu-S-A]  (value not drawn)
J22  D-DMR009PF-D002  [D-DMR009PF-D002]
J23  D-DMR009PF-D002  [D-DMR009PF-D002]
J24  D-DMR009PF-D002  [D-DMR009PF-D002]
J25  D-DMR009PF-D002  [D-DMR009PF-D002]
J26  D-DMR009PF-D002  [D-DMR009PF-D002]

### Ports
+24V (see Top_Sheet[3C], Power_Sheet[5D], Stepper_Driver_Sheet1[5D], Stepper_Driver_Sheet2[5D], Stepper_Driver_Sheet3[5D], Stepper_Driver_Sheet4[5D]), AOUTM1_1 (see Top_Sheet[3D], Stepper_Driver_Sheet1[2D]), AOUTM1_2 (see Top_Sheet[3D], Stepper_Driver_Sheet1[2D]), AOUTM2_1 (see Top_Sheet[3D], Stepper_Driver_Sheet2[2D]), AOUTM2_2 (see Top_Sheet[3D], Stepper_Driver_Sheet2[2D]), AOUTM3_1 (see Top_Sheet[3D], Stepper_Driver_Sheet3[2D]), AOUTM3_2 (see Top_Sheet[3D], Stepper_Driver_Sheet3[2D]), AOUTM4_1 (see Top_Sheet[3D], Stepper_Driver_Sheet4[2D]), AOUTM4_2 (see Top_Sheet[3D], Stepper_Driver_Sheet4[2D]), BOUTM1_1 (see Top_Sheet[3D], Stepper_Driver_Sheet1[2D]), BOUTM1_2 (see Top_Sheet[3D], Stepper_Driver_Sheet1[2D]), BOUTM2_1 (see Top_Sheet[3D], Stepper_Driver_Sheet2[2D]), BOUTM2_2 (see Top_Sheet[3D], Stepper_Driver_Sheet2[2D]), BOUTM3_1 (see Top_Sheet[3D], Stepper_Driver_Sheet3[2D]), BOUTM3_2 (see Top_Sheet[3D], Stepper_Driver_Sheet3[2D]), BOUTM4_1 (see Top_Sheet[3D], Stepper_Driver_Sheet4[2D]), BOUTM4_2 (see Top_Sheet[3D], Stepper_Driver_Sheet4[2D]), CAN_N (see Top_Sheet[3C], CAN_Sheet[3D]), CAN_P (see Top_Sheet[3C], CAN_Sheet[3D]), DIO_DIR1# (see Top_Sheet[4D], DIO_Isolation_Sheet[6C]), DIO_DIR2# (see Top_Sheet[4D], DIO_Isolation_Sheet[6C]), DIO_DIR3# (see Top_Sheet[4D], DIO_Isolation_Sheet[6C]), DIO_DIR4# (see Top_Sheet[4D], DIO_Isolation_Sheet[6C]), DIO_DIR5# (see Top_Sheet[4D], DIO_Isolation_Sheet[6C]), DIO_DIR6# (see Top_Sheet[4D], DIO_Isolation_Sheet[6C]), DIO_DIR7# (see Top_Sheet[4D], DIO_Isolation_Sheet[6C]), DIO_DIR8# (see Top_Sheet[4D], DIO_Isolation_Sheet[6C]), EN1# (see Top_Sheet[4C], DIO_Isolation_Sheet[6B]), EN2# (see Top_Sheet[4C], DIO_Isolation_Sheet[6B]), EN3# (see Top_Sheet[4C], DIO_Isolation_Sheet[6C]), EN4# (see Top_Sheet[4D], DIO_Isolation_Sheet[6C]), EN5# (see Top_Sheet[4D], DIO_Isolation_Sheet[6C]), EN6# (see Top_Sheet[4D], DIO_Isolation_Sheet[6C]), EN7# (see Top_Sheet[4D], DIO_Isolation_Sheet[6C]), EN8# (see Top_Sheet[4D], DIO_Isolation_Sheet[6C]), GND (see Top_Sheet[3C], CAN_Sheet[5D], Controller_Sheet[5D], DIO_Isolation_Sheet[5D], EtherCAT_Sheet[5D], GPIO_EXPANDER_Sheet[5D], Power_Sheet[5D], RJ45_Sheet[5D], RS485_RS232_Sheet[2D], Stepper_Driver_Sheet1[5D], Stepper_Driver_Sheet2[5D], Stepper_Driver_Sheet3[5D], Stepper_Driver_Sheet4[5D]), PULSE1# (see Top_Sheet[3C], DIO_Isolation_Sheet[6C]), PULSE2# (see Top_Sheet[3C], DIO_Isolation_Sheet[6C]), PULSE3# (see Top_Sheet[3C], DIO_Isolation_Sheet[6C]), PULSE4# (see Top_Sheet[3C], DIO_Isolation_Sheet[6C]), PULSE5# (see Top_Sheet[3C], DIO_Isolation_Sheet[6C]), PULSE6# (see Top_Sheet[3C], DIO_Isolation_Sheet[6C]), PULSE7# (see Top_Sheet[3C], DIO_Isolation_Sheet[6C]), PULSE8# (see Top_Sheet[3D], DIO_Isolation_Sheet[6C]), RS232_RX (see Top_Sheet[4C], RS485_RS232_Sheet[5D]), RS232_TX (see Top_Sheet[4C], RS485_RS232_Sheet[5D]), RS485_N (see Top_Sheet[4C], RS485_RS232_Sheet[5D]), RS485_P (see Top_Sheet[4C], RS485_RS232_Sheet[5D])

### Nets
+5V: J8.6 J8.7 J11.6 J11.7 J16.6 J16.7 J22.6 J22.7 J23.6 J23.7 J24.6 J24.7 J25.6 J25.7 J26.6 J26.7
+24V: J20.2 ; port +24V
GND: J8.4 J8.5 J8.8 J8.9 J11.4 J11.5 J11.8 J11.9 J12.3 J16.4 J16.5 J16.8 J16.9 J20.1 J22.4 J22.5 J22.8 J22.9 J23.4 J23.5 J23.8 J23.9 J24.4 J24.5 J24.8 J24.9 J25.4 J25.5 J25.8 J25.9 J26.4 J26.5 J26.8 J26.9 ; port GND
RS232_RX: J14.1 ; port RS232_RX
RS232_TX: J14.2 ; port RS232_TX
AOUTM1_1: J9.1 ; port AOUTM1_1
AOUTM1_2: J9.2 ; port AOUTM1_2
AOUTM2_1: J10.1 ; port AOUTM2_1
AOUTM2_2: J10.2 ; port AOUTM2_2
AOUTM3_1: J15.1 ; port AOUTM3_1
AOUTM3_2: J15.2 ; port AOUTM3_2
AOUTM4_1: J17.1 ; port AOUTM4_1
AOUTM4_2: J17.2 ; port AOUTM4_2
BOUTM1_1: J9.3 ; port BOUTM1_1
BOUTM1_2: J9.4 ; port BOUTM1_2
BOUTM2_1: J10.3 ; port BOUTM2_1
BOUTM2_2: J10.4 ; port BOUTM2_2
BOUTM3_1: J15.3 ; port BOUTM3_1
BOUTM3_2: J15.4 ; port BOUTM3_2
BOUTM4_1: J17.3 ; port BOUTM4_1
BOUTM4_2: J17.4 ; port BOUTM4_2
CAN_N: J12.2 ; port CAN_N
CAN_P: J12.1 ; port CAN_P
DIO_DIR1#: J8.2 ; port DIO_DIR1#
DIO_DIR2#: J11.2 ; port DIO_DIR2#
DIO_DIR3#: J16.2 ; port DIO_DIR3#
DIO_DIR4#: J22.2 ; port DIO_DIR4#
DIO_DIR5#: J23.2 ; port DIO_DIR5#
DIO_DIR6#: J24.2 ; port DIO_DIR6#
DIO_DIR7#: J25.2 ; port DIO_DIR7#
DIO_DIR8#: J26.2 ; port DIO_DIR8#
EN1#: J8.1 ; port EN1#
EN2#: J11.1 ; port EN2#
EN3#: J16.1 ; port EN3#
EN4#: J22.1 ; port EN4#
EN5#: J23.1 ; port EN5#
EN6#: J24.1 ; port EN6#
EN7#: J25.1 ; port EN7#
EN8#: J26.1 ; port EN8#
PULSE1#: J8.3 ; port PULSE1#
PULSE2#: J11.3 ; port PULSE2#
PULSE3#: J16.3 ; port PULSE3#
PULSE4#: J22.3 ; port PULSE4#
PULSE5#: J23.3 ; port PULSE5#
PULSE6#: J24.3 ; port PULSE6#
PULSE7#: J25.3 ; port PULSE7#
PULSE8#: J26.3 ; port PULSE8#
RS485_N: J13.1 ; port RS485_N
RS485_P: J13.2 ; port RS485_P

Not connected (* = marked no-connect by the designer): J8 10(MH1)* 11(MH2)*; J11 10(MH1)* 11(MH2)*; J16 10(MH1)* 11(MH2)*; J22 10(MH1)* 11(MH2)*; J23 10(MH1)* 11(MH2)*; J24 10(MH1)* 11(MH2)*; J25 10(MH1)* 11(MH2)*; J26 10(MH1)* 11(MH2)*

### Notes on the sheet
- MOTOR CONNECTORS
- CAN
- RS-485
- RS-232
- +24V OUTPUT
- DIO CONNECTORS
- File:
- Title:
- Date:
- Page
- Num:
- Total:
- Drawn By: Huzaifa Ali

### Library data of the parts
J8 J11 J16 J22-J26 = D-DMR009PF-D002: 9P Female D-Sub Right-Angle 2 3A -50℃~+105℃ Push-Pull D-Sub / VGA connector ROHS; Manufacturer: Ckmtw; Manufacturer Part Number: D-DMR009PF-D002; Package: Push-Pull; LCSC Part Number: C141882; Item Type: VGA connector; ComponentLink1Description: LCSC; ComponentLink1URL: https://www.lcsc.com/product-detail/D-Sub-VGA-connector_Ckmtw-Shenzhen-Cankemeng-D-DMR009PF-D002_C141882.html
J9 J10 J15 J17 = MX8500-8.5-04P-BK01-Cu-S-A: Tin 4 1 8.5mm -40℃~+105℃ 20A 300V Black 12~22 Straight pin Copper Alloy 2.5 Plugin,P=8.5mm Barrier Terminal Blocks ROHS; Manufacturer: MAX; Manufacturer Part Number: MX8500-8.5-04P-BK01-Cu-S-A; Package: Plugin,P=8.5mm; LCSC Part Number: C5188508; Item Type: Terminal Block; ComponentLink1Description: LCSC; ComponentLink1URL: https://www.lcsc.com/product-detail/Barrier-Terminal-Blocks_MAX-MX8500-8-5-04P-BK01-Cu-S-A_C5188508.html
J12 = WJ500V-5.08-3P: 1x3P 18A -40℃~+105℃ 250V Green 14~30 Straight pin 5.08mm 2.5 1 3 Plugin,P=5.08mm Screw terminal ROHS; Manufacturer: Ningbo Kangnex Elec; Item Type: Terminal Block; Manufacturer Part Number: WJ500V-5.08-3P; Package: Plugin,P=5.08mm; LCSC Part Number: C72334; ComponentLink1Description: LCSC; ComponentLink1URL: https://www.lcsc.com/product-detail/Screw-terminal_Ningbo-Kangnex-Elec-WJ500V-5-08-3P_C72334.html
J13 J14 = 1715721: TERM BLK 2P SIDE ENT 5.08MM PCB; Manufacturer: Phoenix Contact; Item Type: Terminal Blocks; Supplier: Digikey; Supplier Part Number: 277-1263-ND; Manufacturer Part Number: 1715721; RoHS: Yes; Stock: 13160; Pricing: 1=0.94 (USD); ComponentLink1URL: https://datasheet.ciiva.com/1120/1697161-1120393.pdf?src-supplier=Farnell; ComponentLink1Description: https://datasheet.ciiva.com/1120/1697161-1120393.pdf?src-supplier=Farnell; ComponentLink2URL: https://datasheet.ciiva.com/832/1715721-832095.pdf?src-supplier=Digikey; ComponentLink2Description: https://datasheet.ciiva.com/832/1715721-832095.pdf?src-supplier=Digikey; ComponentLink3URL: https://datasheet.ciiva.com/15169/getdatasheetpartid-212174-15169929.pdf?src-supplier=Verical; ComponentLink3Description: https://datasheet.ciiva.com/15169/getdatasheetpartid-212174-15169929.pdf?src-supplier=Verical; ComponentLink4URL: https://datasheet.ciiva.com/16046/1715721-16046034.pdf?src-supplier=Onlinecomponents.com; ComponentLink4Description: https://datasheet.ciiva.com/16046/1715721-16046034.pdf?src-supplier=Onlinecomponents.com
J20 = MXHB9500-9.5-02P-BK01-Cu-S-A: Tin 1x2P Corner pin Three sides 2 1 9.5mm -40℃~+105℃ 20A 300V Black 10~22 Copper Alloy 0.5~4 Plugin,P=9.5mm Barrier Terminal Blocks ROHS; Manufacturer: MAX; Manufacturer Part Number: MXHB9500-9.5-02P-BK01-Cu-S-A; Package: Plugin,P=9.5mm; LCSC Part Number: C7542168; Item Type: Terminal Block; ComponentLink1Description: LCSC; ComponentLink1URL: https://www.lcsc.com/product-detail/Barrier-Terminal-Blocks_MAX-MXHB9500-9-5-02P-BK01-Cu-S-A_C7542168.html